# EasyEDA Pro project LM386_1.epro

# Schematic LM386小板_1
Create Date: 2024-07-10; Page Name: P1; Project Name: 功放; Schematic Name: LM386小板; Update Date: 2024-07-10; Company: 嘉立创EDA; Page Size: A4; Version: V1.0
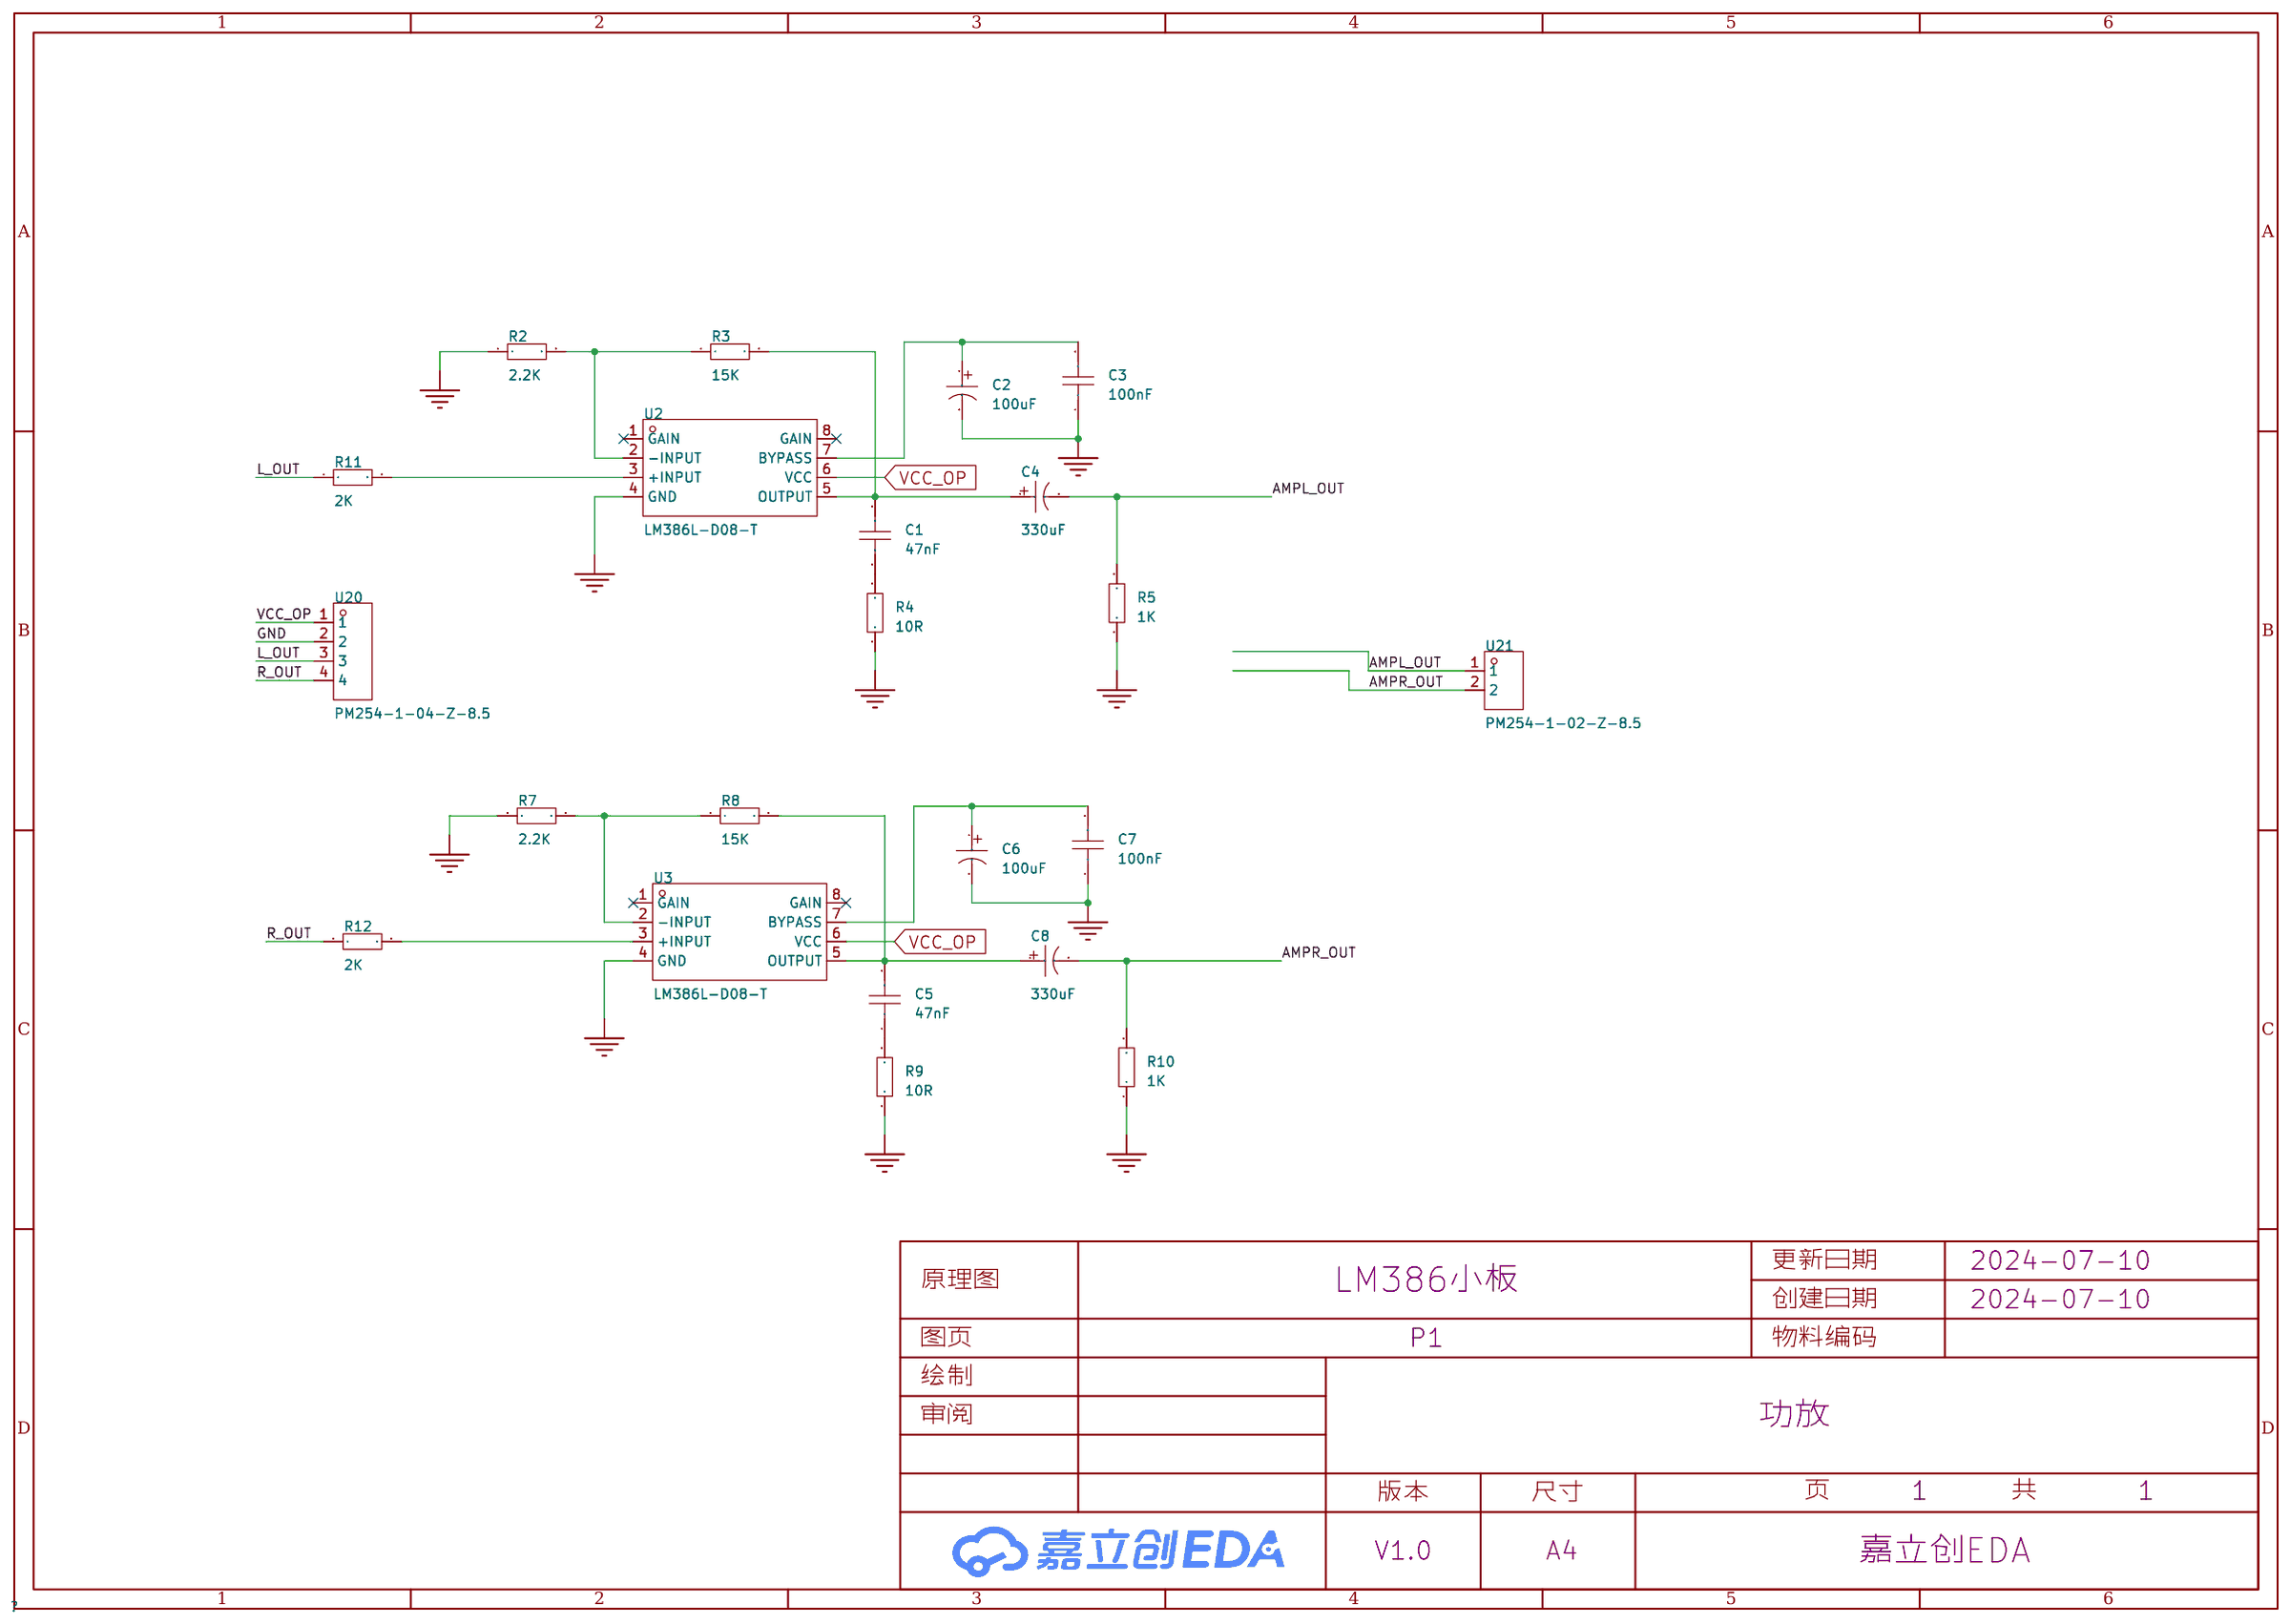
[diagram p0: schematic sheet]

## Parts
C1  47nF  [C0603]
C2  100uF  [CASE-D_7343]
C3  100nF  [C0603]
C4  330uF  [CASE-D_7343]
C5  47nF  [C0603]
C6  100uF  [CASE-D_7343]
C7  100nF  [C0603]
C8  330uF  [CASE-D_7343]
R2  2.2K  [R0603]
R3  15K  [R0603]
R4  10R  [R0603]
R5  1K  [R0603]
R7  2.2K  [R0603]
R8  15K  [R0603]
R9  10R  [R0603]
R10  1K  [R0603]
R11  2K  [R0603]
R12  2K  [R0603]
U2  LM386L-D08-T  [DIP-8_L9.7-W6.4-P2.54-LS7.6-BL]
U3  LM386L-D08-T  [DIP-8_L9.7-W6.4-P2.54-LS7.6-BL]
U20  PM254-1-04-Z-8.5  [HDR-TH_4P-P2.54-V-F]
U21  PM254-1-02-Z-8.5  [HDR-TH_2P-P2.54-V-F]

## Library data of the parts
C1 C3 C5 C7 = CAP_0603: Supplier Footprint: 0603
C2 C6 = TAJD107K016RNJ: 容值:100uF;精度:±10%;额定电压:16V;等效串联电阻:600mΩ@100kHz;; LCSC Part Name: 100uF ±10% 16V; Supplier Part: C7223; Manufacturer: Kyocera AVX; Supplier Footprint: CASE-D-7343; JLCPCB Part Class: Extended Part; Datasheet: https://atta.szlcsc.com/upload/public/pdf/source/20160107/1457707750344.pdf; Supplier: LCSC; Tolerance: ±10%; Rated Voltage: 16V; Equivalent Series Resistance(ESR): 600mΩ@100kHz; Operating Temperature: -55℃~+125℃; Lead Spacing: 2.5mm; φD: 6.3mm; L: 12mm; Lifetime @ Temp: 5000hrs@105℃
C4 C8 = TAJD337K010RNJ: 容值:330uF;精度:±10%;额定电压:10V;等效串联电阻:900mΩ@100kHz;; LCSC Part Name: 330uF ±10% 10V; Supplier Part: C7226; Manufacturer: Kyocera AVX; Supplier Footprint: CASE-D-7343; JLCPCB Part Class: Extended Part; Datasheet: https://atta.szlcsc.com/upload/public/pdf/source/20160107/1457707750344.pdf; Supplier: LCSC; Tolerance: ±10%; Rated Voltage: 10V; Equivalent Series Resistance(ESR): 900mΩ@100kHz; Operating Temperature: -55℃~+125℃; Lead Spacing: 2.5mm; φD: 6.3mm; L: 12mm; Lifetime @ Temp: 5000hrs@105℃
R2-R5 R7-R12 = Res_0603: Supplier Footprint: 0603
U2 U3 = LM386L-D08-T: 功放类型:-;扬声器通道数:单声道;输出功率:700mWx1@8Ω;; Supplier Part: C87306; Manufacturer: UTC(友顺); Supplier Footprint: DIP-8; JLCPCB Part Class: 扩展库; Datasheet: https://atta.szlcsc.com/upload/public/pdf/source/20161112/1478931656207.pdf; Supplier: LCSC; Speaker Channels: 单声道; Output Power: 700mWx1@8Ω; Supply Voltage: 4V~12V
U20 = PM254-1-04-Z-8.5_C2897367: 插孔结构:1x4P;间距:2.54mm;行距:-;圆孔/方孔:方孔;安装类型:直插;排数:单排;总孔位数:4P;额定电流:3A;额定电压:-;插孔方向:顶部;塑高:8.5mm;触头材质:铜合金;工作温度范围:-40℃~+105℃;焊接温度(最大值):260℃@5S;; LCSC Part Name: 1x4P 间距:2.54mm 直插; Supplier Part: C2897367; Manufacturer: HCTL(华灿天禄); Supplier Footprint: 插件,P=2.54mm; JLCPCB Part Class: 扩展库; Datasheet: https://atta.szlcsc.com/upload/public/pdf/source/20230609/534BE42964C679BDE98E061007C4ABD6.pdf; Supplier: LCSC; Holes Structure: 1x4P; Pitch: 2.54mm; Circular Hole / Square Hole: 方孔; Mounting Type: 直插; Number of Rows: 单排; Number of Holes: 4P; Current Rating (Max): 3A; Holes Direction: 顶部; Insulation Height: 8.5mm; Contact Material: 铜合金; Operating Temperature Range: -40℃~+105℃; Soldering Temperature(Max): 260℃@5S
U21 = PM254-1-02-Z-8.5: 插孔结构:1x2P;间距:2.54mm;行距:-;圆孔/方孔:方孔;安装类型:直插;排数:单排;总孔位数:2P;额定电流:3A;额定电压:-;插孔方向:顶部;塑高:8.5mm;触头材质:铜合金;工作温度范围:-40℃~+105℃;焊接温度(最大值):260℃@5S;; LCSC Part Name: 1x2P 间距:2.54mm 直插; Supplier Part: C2897365; Manufacturer: HCTL(华灿天禄); Supplier Footprint: 插件,P=2.54mm; JLCPCB Part Class: 扩展库; Datasheet: https://atta.szlcsc.com/upload/public/pdf/source/20230609/534BE42964C679BDE98E061007C4ABD6.pdf; Supplier: LCSC; Holes Structure: 1x2P; Pitch: 2.54mm; Circular Hole / Square Hole: 方孔; Mounting Type: 直插; Number of Rows: 单排; Number of Holes: 2P; Current Rating (Max): 3A; Holes Direction: 顶部; Insulation Height: 8.5mm; Contact Material: 铜合金; Operating Temperature Range: -40℃~+105℃; Soldering Temperature(Max): 260℃@5S

## Nets
GND: C2.2 C3.1 C6.2 C7.1 R2.1 R4.1 R5.1 R7.1 R9.1 R10.1 U2.4(GND) U3.4(GND) U20.2
VCC_OP: U2.6(VCC) U3.6(VCC) U20.1
AMPL_OUT: C4.2 R5.2 U21.1
AMPR_OUT: C8.2 R10.2 U21.2
L_OUT: R11.1 U20.3
R_OUT: R12.1 U20.4
$1N857: R11.2 U2.3(+INPUT)
$1N1113: C1.1 R4.2
$1N1132: R2.2 R3.1 U2.2(-INPUT)
$1N1297: C2.1 C3.2 U2.7(BYPASS)
$1N1524: C1.2 C4.1 R3.2 U2.5(OUTPUT)
$1N2178: R12.2 U3.3(+INPUT)
$1N2194: C5.1 R9.2
$1N2198: R7.2 R8.1 U3.2(-INPUT)
$1N2203: C6.1 C7.2 U3.7(BYPASS)
$1N2215: C5.2 C8.1 R8.2 U3.5(OUTPUT)

Not connected (* = marked no-connect by the designer): U2 1(GAIN)* 8(GAIN)*; U3 1(GAIN)* 8(GAIN)*

# Board LM386小板_1
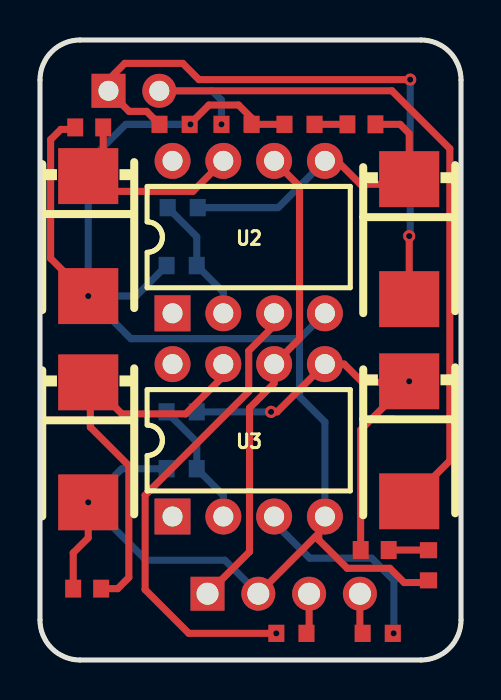
[diagram p1: board, top side]
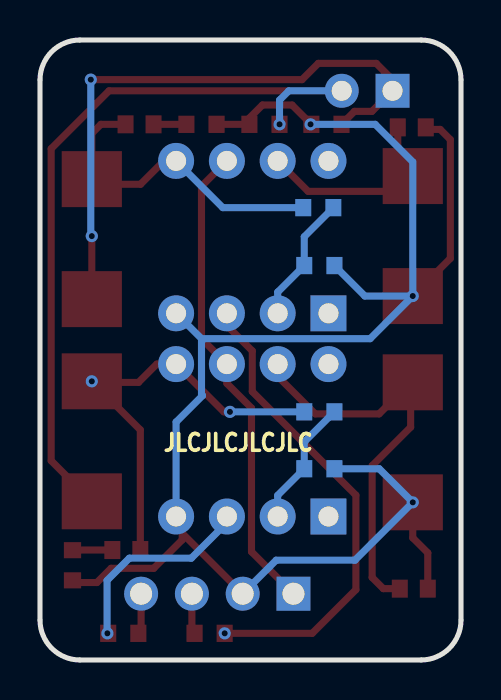
[diagram p2: board, bottom side, seen from below]

Outline 21.06 x 31 mm; copper layers: Top Layer, Bottom Layer. Coordinates in mm from the lower left corner of the outline.
Outline path: 0,29 0,2 arc(0.59,0.59) 2,0 19.06,0 arc(20.47,0.59) 21.06,2 21.06,29 arc(20.47,30.41) 19.06,31 2,31 arc(0.59,30.41) 0,29
Stack: Top Layer 0.035mm / Dielectric1 1.51mm FR4 er 4.5 / Bottom Layer 0.035mm

## Design rules (mm)
template: JLCPCB Capability(Two Layers Board)
spacing copperThickness1oz (default): track to track 0.102, other pairs 0.152 to 0.3
spacing copperThickness2oz: track to track 0.203, other pairs 0.152 to 0.3
track width copperThickness1oz (default): min 0.127, default 0.254, max 2.54
track width copperThickness2oz: min 0.203, default 0.254, max 2.54
differential pair differentialPair (default): width min 0.127, default 0.254, max 2.54; gap min 0.152, default 0.152
via viaSize (default): diameter min 0.5, default 0.61, max 10; hole min 0.3, default 0.305, max 6.3

## Placement (name value [footprint] x y rotation side)
C1  47nF  [C0603]  16.08 26.78 0 top
C2  100uF  [CASE-D_7343]  2.41 21.2 90 top
C3  100nF  [C0603]  2.46 26.63 0 top
C4  330uF  [CASE-D_7343]  18.47 21.04 90 top
C5  47nF  [C0603]  16.74 5.5 180 top
C6  100uF  [CASE-D_7343]  2.41 10.88 90 top
C7  100nF  [C0603]  2.36 3.57 0 top
C8  330uF  [CASE-D_7343]  18.47 10.93 90 top
R2  2.2K  [R0603]  7.09 19.72 0 bottom
R3  15K  [R0603]  7.14 22.62 0 bottom
R4  10R  [R0603]  12.98 26.78 0 top
R5  1K  [R0603]  6.73 26.78 180 top
R7  2.2K  [R0603]  7.09 9.56 0 bottom
R8  15K  [R0603]  7.09 12.41 0 bottom
R9  10R  [R0603]  19.43 4.74 90 top
R10  1K  [R0603]  9.83 26.78 180 top
R11  2K  [R0603]  12.57 1.33 180 top
R12  2K  [R0603]  16.89 1.33 0 top
U2  LM386L-D08-T  [DIP-8_L9.7-W6.4-P2.54-LS7.6-BL]  10.44 21.14 0 top
U3  LM386L-D08-T  [DIP-8_L9.7-W6.4-P2.54-LS7.6-BL]  10.44 10.98 0 top
U20  PM254-1-04-Z-8.5  [HDR-TH_4P-P2.54-V-F]  12.19 3.31 0 top
U21  PM254-1-02-Z-8.5  [HDR-TH_2P-P2.54-V-F]  4.7 28.46 0 top

## Footprints (pads in the part's own frame, mm; a bottom-side part is the same pattern mirrored in y, then rotated)
C0603
  rect 0.8x0.9 smd: 1(-0.7,0) 2(0.7,0)
CASE-D_7343
  rect 2.799x3.01 smd: 1(3,0) 2(-3,0)
DIP-8_L9.7-W6.4-P2.54-LS7.6-BL
  rect 1.8x1.8 hole 1: 1(-3.81,-3.81)
  round 1.8 hole 1: 2(-1.27,-3.81) 3(1.27,-3.81) 4(3.81,-3.81) 5(3.81,3.81) 6(1.27,3.81) 7(-1.27,3.81) 8(-3.81,3.81)
HDR-TH_2P-P2.54-V-F
  rect 1.7x1.7 hole 1: 1(-1.27,0)
  round 1.7 hole 1: 2(1.27,0)
HDR-TH_4P-P2.54-V-F
  rect 1.7x1.7 hole 1.1: 1(-3.81,0)
  round 1.7 hole 1.1: 2(-1.27,0) 3(1.27,0) 4(3.81,0)
R0603
  rect 0.806x0.864 smd: 1(-0.753,0) 2(0.753,0)

## Nets
As in the schematic.

Pads without a net: U2 1 8; U3 1 8

## Via types
v1: diameter 0.61, hole 0.305, Top Layer to Bottom Layer, 10 vias

## Routing (per net, layer and track width the routed paths; a pad name or vN(x,y) marks a point on that pad's centre or on a via; arc(x,y) is an arc through that point)
GND: length 86.3
  Top Layer w0.355: v1(2.41,18.2) 0.53,20.08 0.53,26.02 1.04,26.53 1.66,26.53 C3.1 ; R5.1 8.45,27.75 9.93,27.75 10.58,27.1 R10.1 R4.1 ; C7.1 1.66,5.36 2.41,6.11 v1(2.41,7.88) ; R9.1 19.32,3.87 18.21,3.87 17.5,4.58 15.37,4.58 13.94,6.01 13.94,6.34 U20.2
  Bottom Layer w0.355: 12.98,16.06 U2.4 ; 12.98,16.06 12.98,13.27 12.93,13.22 14.25,11.9 U3.4 ; 12.98,16.06 4.55,16.06 v1(2.41,18.2) ; R2.1 4.81,18.2 v1(2.41,18.2) ; v1(7.53,26.78) 4.29,26.78 2.41,24.9 v1(2.41,18.2) ; U20.2 9.24,4.99 5.31,4.99 v1(2.41,7.88) 4.09,9.56 R7.1
VCC_OP: length 24.1
  Top Layer w0.355: 11.71,24.95 12.98,23.69 12.98,16.06 11.71,14.8 11.71,13.83 10.48,12.6 10.48,5.41 U20.1
AMPL_OUT: length 30.6
  Top Layer w0.355: C4.2 v1(18.47,21.2) ; v1(18.52,29.02) 7.95,29.02 7.14,29.83 4.24,29.83 3.43,29.02 U21.1 4.45,27.43 5.33,27.43 R5.2
  Bottom Layer w0.355: v1(18.47,21.2) 18.52,21.25 v1(18.52,29.02)
AMPR_OUT: length 38.7
  Top Layer w0.355: U21.2 17.6,28.46 20.5,25.56 20.5,9.97 C8.2
  Bottom Layer w0.355: U21.2 8.61,28.46 9.08,27.99 v1(9.08,26.78)
L_OUT: length 2
  Top Layer w0.355: R11.1 13.46,1.47 U20.3
R_OUT: length 2
  Top Layer w0.355: U20.4 16,1.47 R12.1
$1N857: length 24
  Top Layer w0.355: 11.71,17.33 11.71,16.72 10.44,15.45 10.44,13.42 5.26,8.24 5.26,3.52 7.44,1.33 v1(11.82,1.33)
$1N1113: length 1.6
  Top Layer w0.355: C1.1 R4.2
$1N1132: length 6.4
  Bottom Layer w0.355: U2.2 9.17,18.39 R2.2 7.84,21.16 R3.1
$1N1297: length 10.5
  Top Layer w0.355: C3.2 3.16,24.95 C2.1 3.18,23.43 7.65,23.43 U2.7
$1N1524: length 16.3
  Top Layer w0.355: U2.5 14.86,24.95 16.03,23.79 18.21,23.79 C4.1 18.47,26.33 18.01,26.78 C1.2
  Bottom Layer w0.355: R3.2 11.91,22.62 U2.5
$1N2178: length 10.3
  Bottom Layer w0.355: 11.4,7.17 13.49,5.09 16.59,5.09 17.7,3.97 17.7,1.35 v1(17.69,1.33)
$1N2194: length 2
  Top Layer w0.355: R9.2 19.42,5.5 C5.1
$1N2198: length 6.4
  Bottom Layer w0.355: R8.1 7.84,10.9 R7.2 9.17,8.23 U3.2
$1N2203: length 21
  Top Layer w0.355: 2.52,13.88 4.09,12.31 7.29,12.31 9.17,14.19 U3.7 ; 2.52,13.88 C6.1 ; 2.52,13.88 2.52,11.64 4.44,9.72 4.44,4.13 3.89,3.57 C7.2
$1N2215: length 21.4
  Top Layer w0.355: 18.41,13.88 16.13,13.88 15.21,14.8 U3.5 11.86,12.41 v1(11.56,12.41) ; 18.41,13.88 v1(18.47,13.93) ; 18.41,13.88 16.04,11.51 C5.2
  Bottom Layer w0.355: v1(11.56,12.41) R8.2

## Text on the board
Bottom Silkscreen Layer: JLCJLCJLCJLC
